# Altium project zx_revo_a3.PrjPcb (part 3 of 3)

## Sheet Gamepads.SchDoc
size A4; SheetNumber: 10; SheetTotal: 15
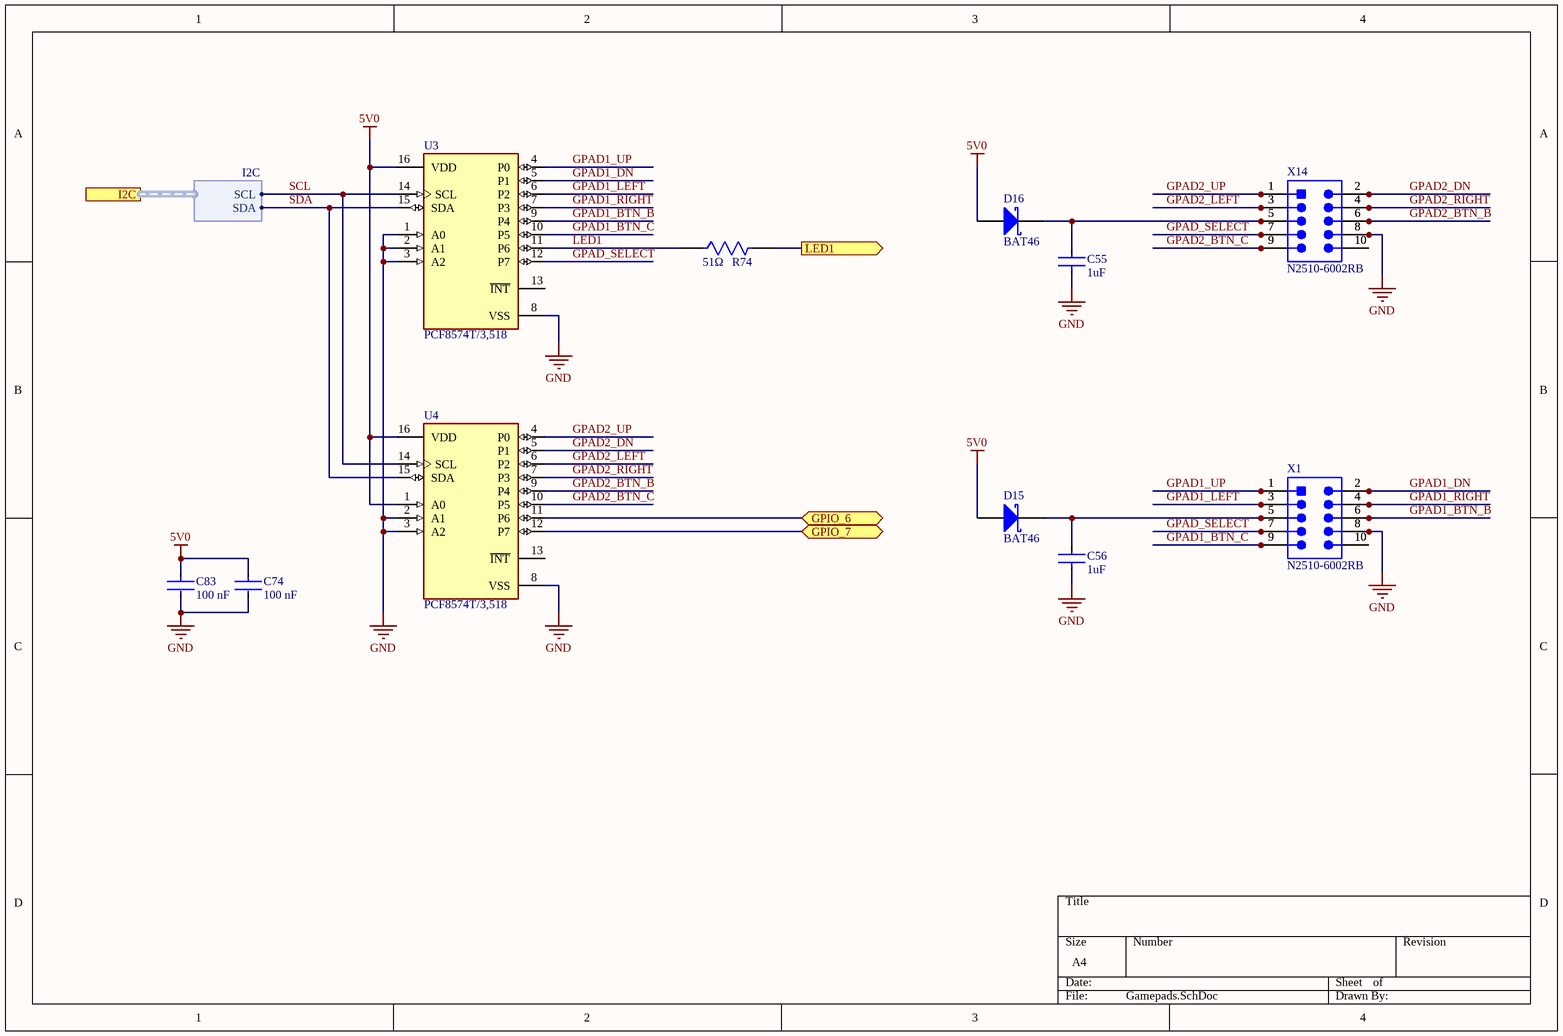
[diagram p13: Gamepads.SchDoc]

### Parts
C55  Capacitance: 1uF  [FP-GCM21B-0_15-IPC_A]  (hidden comment: GCM21BR71E105KA56L)
C56  Capacitance: 1uF  [FP-GCM21B-0_15-IPC_A]  (hidden comment: GCM21BR71E105KA56L)
C74  Capacitance: 100 nF  [FP-CC0805-0_85-IPC_A]  (hidden comment: CC0805KRX7R9BB104)
C83  Capacitance: 100 nF  [FP-CC0805-0_85-IPC_A]  (hidden comment: CC0805KRX7R9BB104)
D15  BAT46  [STM-DO-35-2]
D16  BAT46  [STM-DO-35-2]
R74  Resistance: 51Ω  [FP-RR1220-IPC_A]  (hidden comment: RR1220Q-510-D)
U3  PCF8574T/3,518  [FP-SOT162-1-MFG]
U4  PCF8574T/3,518  [FP-SOT162-1-MFG]
X1  N2510-6002RB  [3M-N2510-6002-10_V]
X14  N2510-6002RB  [3M-N2510-6002-10_V]

### Ports
GPIO_6 (bidir), GPIO_7 (bidir), I2C (harness I2C), LED1 (out)

### Harnesses
I2C: SDA, SCL

### Nets
5V0: C74.1 C83.1 D15.1(A) D16.1(A) U3.16(VDD) U4.1(A0) U4.16(VDD)
GND: C55.1 C56.1 C74.2 C83.2 U3.1(A0) U3.2(A1) U3.3(A2) U3.8(VSS) U4.2(A1) U4.3(A2) U4.8(VSS) X1.8 X14.8
GPAD1_BTN_B: U3.9(P4) X1.6  [project net GPAD1_BTN_B_10]
GPAD1_BTN_C: U3.10(P5) X1.9  [project net GPAD1_BTN_C_10]
GPAD1_DN: U3.5(P1) X1.2  [project net GPAD1_DN_10]
GPAD1_LEFT: U3.6(P2) X1.3  [project net GPAD1_LEFT_10]
GPAD1_RIGHT: U3.7(P3) X1.4  [project net GPAD1_RIGHT_10]
GPAD1_UP: U3.4(P0) X1.1  [project net GPAD1_UP_10]
GPAD2_BTN_B: U4.9(P4) X14.6  [project net GPAD2_BTN_B_10]
GPAD2_BTN_C: U4.10(P5) X14.9  [project net GPAD2_BTN_C_10]
GPAD2_DN: U4.5(P1) X14.2  [project net GPAD2_DN_10]
GPAD2_LEFT: U4.6(P2) X14.3  [project net GPAD2_LEFT_10]
GPAD2_RIGHT: U4.7(P3) X14.4  [project net GPAD2_RIGHT_10]
GPAD2_UP: U4.4(P0) X14.1  [project net GPAD2_UP_10]
GPAD_SELECT: U3.12(P7) X1.7 X14.7  [project net GPAD_SELECT_10]
LED1: R74.1 U3.11(P6)  [project net LED1_10]
SCL: U3.14(SCL) U4.14(SCL) ; port I2C.SCL  [project net I2C.SCL]
SDA: U3.15(SDA) U4.15(SDA) ; port I2C.SDA  [project net I2C.SDA]
NetC55_2: C55.2 D16.2(K) X14.5
NetC56_2: C56.2 D15.2(K) X1.5
NetR74_2: R74.2 ; port LED1
NetU4_11: U4.11(P6) ; port GPIO_6
NetU4_12: U4.12(P7) ; port GPIO_7

Not connected (* = marked no-connect by the designer): U3 13(~{INT}); U4 13(~{INT}); X1 10; X14 10

### Library data of the parts
C55 C56 = CMP-2007-03346-2: Ceramic Capacitor for Automotive 1uF ±10% 25VDC X7R 0805 Embossed T/R; Manufacturer: Murata; Termination: SMD/SMT; Case/Package: 0805; Manufacturer Part Number: GCM21BR71E105KA56L; value: 1uF; Category: Cap
C74 C83 = CMP-2100-03606-3: CAP CER 0.1UF 50V X7R 0805; Manufacturer: Yageo; Value: 100 nF; Category: Cap; Manufacturer Part Number: CC0805KRX7R9BB104; Case/Package: 0805
D15 D16 = CMP-2000-05926-1: Small Signal Schottky Diode, 150 mA, 100 V, -65 to 125 degC, 2-Pin DO-35, RoHS, Tape and Reel; Manufacturer: STMicroelectronics; Manufacturer Part Number: BAT46; value: BAT46; Category: Diode
R74 = CMP-2001-03561-2: 51Ω ±0.5% 0.1W 1/10W Chip Resistor 0805 (2012 Metric) Thin Film; Manufacturer: Susumu; Case/Package: 0805; Number of Terminations: 2; Termination: SMD/SMT; Number of Pins: 2; Manufacturer Part Number: RR1220Q-510-D; value: 51Ω; Category: Res
U3 U4 = CMP-10112-000010-1: IC I/O EXPANDER I2C 8B 16SOIC; Manufacturer: NXP Semiconductors; Manufacturer Part Number: PCF8574T/3,518; Category: IC; value: PCF8574T/3,518; Case/Package: SOT162-1
X1 X14 = CMP-2000-06794-1: Male Header, Pitch 2.54 mm, 2 x 5 Postion, Height 9.91 mm, Tail Length 2.84 mm, -55 to 105 degC, RoHS, Bulk; PartNumber: N2510; Manufacturer: 3M; Pitch: 2.54mm; value: 10-Pin Shrouded Header, 2.54mm; Manufacturer Part Number: N2510-6002RB; Case/Package: IDC-10; Category: Connector

## Nets that join several sheets
2V5: FPGA (12 pins), Power ATX (10 pins)
3V3: FPGA (22 pins), CPLD (16 pins), SDCARD (9 pins), Power ATX (10 pins), ESP32 (14 pins), AY Amp (9 pins)
5V0: FPGA (7 pins), CPU ROM (13 pins), FDC (21 pins), Video out (J8.18 R37.1 R43.1), Power ATX (15 pins), USB (14 pins), ESP32 (6 pins), AY Amp (7 pins), Tape (C107.1 D2.14), Gamepads (7 pins)
5V0_ATX: BUS (10 pins), Power ATX (6 pins)
12V0_ATX: BUS (C3.1 J1.0), Power ATX (PWR1.10)
GND: FPGA (35 pins), CPU ROM (5 pins), BUS (18 pins), FDC (39 pins), CPLD (16 pins), Video out (11 pins), SDCARD (12 pins), Power ATX (46 pins), USB (24 pins), ESP32 (23 pins), AY Amp (30 pins), Tape (9 pins), Gamepads (13 pins)
STB_3V3: Power ATX (5 pins), USB (C38.1 D8.4 D8.16), ESP32 (5 pins)
VG93_12V: FDC (C45.2 D6.40), Power ATX (5 pins)
VUSB: Power ATX (Q11.5,6 Q11.8,7), USB (J7.A4_B9 J7.B4_A9)
A0: FPGA (D9.44), CPU ROM (D1.27 D18.12), BUS (XS1.A9 XS2.A9)
A1: FPGA (D9.41), CPU ROM (D1.28 D18.11), BUS (XS1.A10 XS2.A10)
A2: FPGA (D9.40), CPU ROM (D1.29 D18.10), BUS (XS1.A11 XS2.A11)
A3: FPGA (D9.39), CPU ROM (D1.30 D18.9), BUS (XS1.A12 XS2.A12)
A4: FPGA (D9.38), CPU ROM (D1.31 D18.8), BUS (XS1.A24 XS2.A24)
A5: FPGA (D9.37), CPU ROM (D1.32 D18.7), BUS (XS1.A23 XS2.A23), FDC (D6.5)
A6: FPGA (D9.36), CPU ROM (D1.34 D18.6), BUS (XS1.A22 XS2.A22), FDC (D6.6)
A7: FPGA (D9.31), CPU ROM (D1.35 D18.5), BUS (XS1.A21 XS2.A21)
A8: FPGA (D9.30), CPU ROM (D1.36 D18.27), BUS (XS1.B26 XS2.B26)
A9: FPGA (D9.29), CPU ROM (D1.37 D18.26), BUS (XS1.A27 XS2.A27)
A10: FPGA (D9.28), CPU ROM (D1.38 D18.23), BUS (XS1.B27 XS2.B27)
A11: FPGA (D9.27), CPU ROM (D1.40 D18.25), BUS (XS1.A28 XS2.A28)
A12: FPGA (D9.26), CPU ROM (D1.41 D18.4), BUS (XS1.A2 XS2.A2)
A13: FPGA (D9.25), CPU ROM (D1.42 D18.28), BUS (XS1.B2 XS2.B2)
A14: FPGA (D9.24), CPU ROM (D1.43), BUS (XS1.A1 XS2.A1)
A15: FPGA (D9.19), CPU ROM (D1.44), BUS (XS1.B1 XS2.B1)
AC97_CLK: Video out (U6.4), AY Amp (D4.11)
ADCDAT: Video out (U6.5), ESP32 (D17.35), AY Amp (D4.16)
ATX_POWERON: Power ATX (R107.2 VT1.1 VT2.1), ESP32 (R64.2)
AY_BC1: FPGA (D9.136), AY Amp (D5.29)
AY_BDIR: FPGA (D9.135), AY Amp (D5.27)
~{BEEP}: AY Amp (D2.5), Tape (D2.2 D2.3)
~{BUSA}: CPU ROM (D1.20), BUS (XS1.A26 XS2.A26)
~{BUSR}: CPU ROM (D1.22 R8.2), BUS (XS1.A19 XS2.A19)
BCLK: Video out (U6.9), ESP32 (D17.32), AY Amp (D4.12)
BEEP: FPGA (D9.133 R83.1), Tape (D2.1)
~{CONFIG}: FPGA (D9.105), ESP32 (D17.22 R75.1)
~{CPLD_SSEL}: CPLD (U7.73), ESP32 (D17.15 R63.2)
~{CSROM}: FPGA (D3.6), BUS (R10.2 XS1.A25 XS2.A25)
CLKZ: FPGA (R18.2), CPU ROM (D1.1)
CONFDONE: FPGA (D9.2), ESP32 (D17.17 R66.1)
D0: FPGA (D9.18), CPU ROM (D1.9 D18.13), BUS (XS1.B6 XS2.B6), FDC (5 pins), AY Amp (D5.37 U1.11)
D1: FPGA (D9.17), CPU ROM (D1.10 D18.14), BUS (XS1.B7 XS2.B7), FDC (5 pins), AY Amp (D5.36 U1.10)
D2: FPGA (D9.16), CPU ROM (D1.7 D18.15), BUS (XS1.B8 XS2.B8), FDC (5 pins), AY Amp (D5.35 U1.9)
D3: FPGA (D9.15), CPU ROM (D1.3 D18.17), BUS (XS1.B11 XS2.B11), FDC (5 pins), AY Amp (D5.34 U1.8)
D4: FPGA (D9.14), CPU ROM (D1.2 D18.18), BUS (XS1.B12 XS2.B12), FDC (5 pins), AY Amp (D5.33 U1.7)
D5: FPGA (D9.13), CPU ROM (D1.4 D18.19), BUS (XS1.B10 XS2.B10), FDC (5 pins), AY Amp (D5.32 U1.6)
D6: FPGA (D9.12), CPU ROM (D1.5 D18.20), BUS (XS1.B9 XS2.B9), FDC (5 pins), AY Amp (D5.31 U1.5)
D7: FPGA (D9.11), CPU ROM (D1.8 D18.21), BUS (XS1.B3 XS2.B3), FDC (5 pins), AY Amp (D5.30 U1.4)
~{DOS}: FPGA (D9.160), CPU ROM (D18.3), BUS (XS1.A4 XS2.A4)
DAC_CLK: FPGA (D9.103), CPLD (U7.12), Video out (U6.53)
DACDAT: ESP32 (D17.34), AY Amp (D4.14)
DACLRC: Video out (U6.10), ESP32 (D17.33), AY Amp (D4.13)
DATA0: FPGA (D9.156), ESP32 (D17.11)
DCLK: FPGA (D9.155), ESP32 (D17.10 R76.1)
DTR: FPGA (R110.1), ESP32 (Q6.2 RN3.1)
DTR_TTL: FPGA (R110.2), USB (D8.13)
ESP32_MASTER.MISO: CPLD (U7.83), ESP32 (D17.28 R99.2)
ESP32_MASTER.MOSI: CPLD (U7.81), ESP32 (D17.30 R105.2)
ESP32_MASTER.~{SSEL}: CPLD (U7.78), ESP32 (D17.31 R104.2)
ESP32_MASTER.SCLK: CPLD (U7.82), ESP32 (D17.29 R98.2)
ESP32_RXD: FPGA (R109.1), ESP32 (D17.36)
ESP32_SLAVE.MISO: CPLD (U7.86), ESP32 (D17.19)
ESP32_SLAVE.MOSI: CPLD (U7.84), ESP32 (D17.21)
ESP32_SLAVE.~{SSEL}: CPLD (U7.87), ESP32 (D17.18)
ESP32_SLAVE.SCLK: CPLD (U7.85), ESP32 (D17.20)
ESP32_TXD: FPGA (R108.1), ESP32 (D17.37)
FPGA_SEL0: FPGA (D9.97), CPLD (U7.74)
FPGA_SEL1: FPGA (D9.99), CPLD (U7.75)
~{HALT}: CPU ROM (D1.14), BUS (XS1.B15 XS2.B15)
HSYNC: FPGA (D9.111), CPLD (U7.51), Video out (U6.64)
I2C.SCL: FPGA (X22.3 X23.3 X24.3), Video out (U6.35), ESP32 (D17.38 R51.2), AY Amp (D4.17), Gamepads (U3.14 U4.14)
I2C.SDA: FPGA (X22.2 X23.2 X24.2), Video out (U6.36), ESP32 (D17.39 R52.2), AY Amp (D4.18), Gamepads (U3.15 U4.15)
~{INT}: FPGA (D9.10), CPU ROM (D1.12 R1.1), BUS (XS1.B13 XS2.B13)
~{IORQ}: FPGA (D9.7), CPU ROM (D1.16 R4.2)
~{IORQ1}: FPGA (D9.148), BUS (XS1.B17)
~{IORQ2}: FPGA (D9.149), BUS (XS1.B31 XS2.B17)
IORQGE1: FPGA (D9.78), BUS (R11.2 XS1.A13)
IORQGE2: FPGA (D9.80), BUS (R9.2 XS1.A31 XS2.A13)
~{M1}: FPGA (D9.144), CPU ROM (D1.24), BUS (XS1.B24 XS2.B24)
~{MREQ}: FPGA (D9.8), CPU ROM (D1.15 R3.2), BUS (XS1.B16 XS2.B16)
~{NMI}: FPGA (D9.9), CPU ROM (D1.13 R2.1), BUS (XS1.B14 XS2.B14)
NetR74_2: FPGA (VD5.K), Gamepads (R74.2)
~{RD}: FPGA (D9.141), CPU ROM (D1.18 R5.2), BUS (XS1.B18 XS2.B18), FDC (D6.4)
~{RDROM}: CPU ROM (D18.22), BUS (R10.1 XS1.A15 XS2.A15)
~{RES}: FPGA (R13.2), CPU ROM (D1.23), BUS (XS1.A20 XS2.A20), AY Amp (D5.23)
~{RFSH}: FPGA (D9.147), CPU ROM (D1.25), BUS (XS1.B25 XS2.B25)
~{ROMOE}: FPGA (D9.167), CPU ROM (D18.24)
~{ROMWE}: FPGA (D9.166), CPU ROM (D18.31)
ROMPG2: FPGA (D9.164), CPU ROM (D18.2)
ROMPG3: FPGA (D9.163), CPU ROM (D18.30)
ROMPG4: FPGA (D9.162), CPU ROM (D18.1)
RS: FPGA (R12.2), CPU ROM (D18.29), BUS (XS1.A16 XS2.A16)
RTS: FPGA (R111.1), ESP32 (Q5.2 RN3.2)
RTS_TTL: FPGA (R111.2), USB (D8.14)
RXD_TTL: FPGA (R109.2), USB (D8.2)
~{SD0_SSEL}: CPLD (U7.92), SDCARD (CD1.2)
~{SD1_SSEL}: CPLD (U7.88), SDCARD (CD2.2 X25.1)
~{SOFTRST}: CPLD (U7.4), USB (U2.17), ESP32 (5 pins)
~{SPI_SLAVE_IRQ}: FPGA (D9.159), ESP32 (D17.25)
~{SPI_SLAVE_SSEL}: FPGA (D9.182), CPLD (U7.5)
~{STATUS}: FPGA (D9.52), ESP32 (D17.12 R65.1)
SD0_MISO: CPLD (U7.97), SDCARD (CD1.7 RN1.2)
SD0_MOSI: CPLD (U7.95), SDCARD (CD1.3)
SD0_SCLK: CPLD (U7.96), SDCARD (CD1.5)
SD1_MISO: CPLD (U7.91), SDCARD (CD2.7 RN2.2 X25.6)
SD1_MOSI: CPLD (U7.89), SDCARD (CD2.3 X25.2)
SD1_SCLK: CPLD (U7.90), SDCARD (CD2.5 X25.4)
SPI_HOST.MISO: FPGA (D9.115), CPLD (U7.48)
SPI_HOST.MOSI: FPGA (D9.116), CPLD (U7.47)
SPI_HOST.~{SSEL}: FPGA (D9.119), CPLD (U7.44)
SPI_HOST.SCLK: FPGA (R60.2), CPLD (U7.49)
SPI_SLAVE.MISO: FPGA (D9.158), CPLD (U7.8)
SPI_SLAVE.MOSI: FPGA (D9.157), CPLD (U7.7)
SPI_SLAVE.SCLK: FPGA (D9.184), CPLD (U7.6)
STEP: FPGA (D9.46), FDC (D6.15 D12.5)
TAPE_BIT: ESP32 (D17.23), Tape (D2.8)
TCK_FPGA: FPGA (D9.1 R72.2 X15.1), CPLD (U7.24)
TDO_CPLD: FPGA (X15.3), CPLD (U7.25)
TDO_FPGA: FPGA (D9.4), CPLD (U7.23)
TMS_FPGA: FPGA (D9.50 R73.2 X15.5), CPLD (U7.22)
TXD_TTL: FPGA (R108.2), USB (D8.3)
USB_n: USB (U2.15), ESP32 (D17.13 X17.1)
USB_p: USB (U2.16), ESP32 (D17.14 X17.2)
~{VG_CS}: FPGA (D9.45), FDC (D6.3 R62.1)
~{VG_RES}: FPGA (D9.54), FDC (D6.19 D10.3 R38.2)
VDAT0: FPGA (D9.96), CPLD (U7.52)
VDAT1: FPGA (D9.94), CPLD (U7.54)
VDAT2: FPGA (D9.92), CPLD (U7.56)
VDAT3: FPGA (D9.89), CPLD (U7.58)
VDAT4: FPGA (D9.87), CPLD (U7.64)
VDAT5: FPGA (D9.85), CPLD (U7.67)
VDAT6: FPGA (D9.75), CPLD (U7.69)
VDAT7: FPGA (D9.73), CPLD (U7.71)
VDAT8: FPGA (D9.71), CPLD (U7.72)
VDAT9: FPGA (D9.74), CPLD (U7.70)
VDAT10: FPGA (D9.83), CPLD (U7.68)
VDAT11: FPGA (D9.86), CPLD (U7.66)
VDAT12: FPGA (D9.88), CPLD (U7.61)
VDAT13: FPGA (D9.90), CPLD (U7.57)
VDAT14: FPGA (D9.93), CPLD (U7.55)
VDAT15: FPGA (D9.95), CPLD (U7.53)
VG_A0: FPGA (D9.69), FDC (D10.1)
VG_A1: FPGA (D9.70), FDC (D10.2)
VG_CLK: FPGA (D9.56), FDC (D6.24)
VG_DRQ: FPGA (D9.63), FDC (D6.38 R61.1)
VG_HRDY: FPGA (D9.55), FDC (D6.23 D7.13)
VG_IRQ: FPGA (D9.64), FDC (D6.39 R59.1)
VG_RAWR: FPGA (D9.58), FDC (D6.27)
VG_RCLK: FPGA (D9.57), FDC (D6.26)
VG_SIDE: FPGA (D9.65), FDC (D12.11)
VG_SL: FPGA (D9.47), FDC (D6.17)
VG_SR: FPGA (D9.53), FDC (D6.18)
VG_TR43: FPGA (D9.60), FDC (D6.29)
VG_WD: FPGA (D9.61), FDC (D6.31)
VG_WRD: FPGA (D9.67), FDC (D12.9)
VSYNC: FPGA (D9.112), CPLD (U7.50), Video out (U6.2)
~{WAIT}: FPGA (D9.143), CPU ROM (D1.21 R7.1), BUS (XS1.B21 XS2.B21)
~{WR}: FPGA (D9.140), CPU ROM (D1.19 R6.2), BUS (XS1.B19 XS2.B19), FDC (D6.2)
WRDAC: FPGA (D9.113), AY Amp (U1.13)